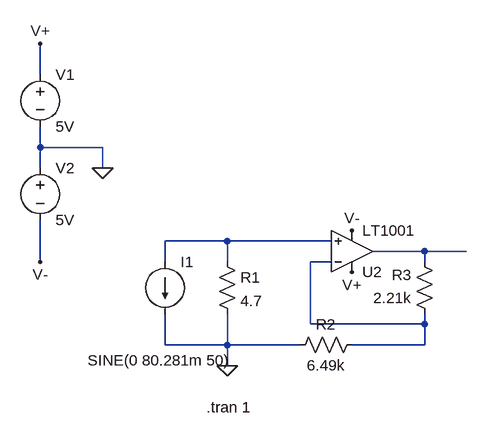
[diagram p0: schematic Strommessung.asc]
Strommessung.asc, the LTspice schematic file:
Version 4
SHEET 1 880 680
WIRE -256 -144 -256 -192
WIRE -256 -32 -256 -64
WIRE -160 -32 -256 -32
WIRE -256 0 -256 -32
WIRE -160 0 -160 -32
WIRE 32 112 -64 112
WIRE 192 112 32 112
WIRE 336 128 256 128
WIRE 400 128 336 128
WIRE -256 144 -256 80
WIRE -64 144 -64 112
WIRE 32 144 32 112
WIRE 192 144 160 144
WIRE 336 144 336 128
WIRE 160 240 160 144
WIRE 336 240 336 224
WIRE 336 240 160 240
WIRE -64 272 -64 224
WIRE 32 272 32 224
WIRE 32 272 -64 272
WIRE 144 272 32 272
WIRE 336 272 336 240
WIRE 336 272 224 272
WIRE 32 304 32 272
FLAG 224 160 V+
FLAG -256 -192 V+
FLAG 224 96 V-
FLAG -256 144 V-
FLAG -160 0 0
FLAG 32 304 0
SYMBOL voltage -256 -160 R0
WINDOW 123 0 0 Left 2
WINDOW 39 0 0 Left 2
SYMATTR InstName V1
SYMATTR Value 5V
SYMBOL voltage -256 -16 R0
WINDOW 123 0 0 Left 2
WINDOW 39 0 0 Left 2
SYMATTR InstName V2
SYMATTR Value 5V
SYMBOL current -64 144 R0
WINDOW 3 -119 152 Left 2
WINDOW 123 0 0 Left 2
WINDOW 39 0 0 Left 2
SYMATTR InstName I1
SYMATTR Value SINE(0 80.281m 50)
SYMBOL res 16 128 R0
SYMATTR InstName R1
SYMATTR Value 4.7
SYMBOL res 240 256 R90
WINDOW 0 0 56 VBottom 2
WINDOW 3 32 56 VTop 2
SYMATTR InstName R2
SYMATTR Value 6.49k
SYMBOL res 352 240 R180
WINDOW 0 36 76 Left 2
WINDOW 3 36 40 Left 2
SYMATTR InstName R3
SYMATTR Value 2.21k
SYMBOL Opamps\\LT1001 224 192 M180
SYMATTR InstName U2
TEXT 0 368 Left 2 !.tran 1

The netlist it stands for:
* Strommessung.asc
V1 V+ 0 5V
V2 0 V- 5V
I1 N001 0 SINE(0 80.281m 50)
R1 N001 0 4.7
R2 N003 0 6.49k
R3 N003 N002 2.21k
XU2 N001 N003 V+ V- N002 LT1001  ; pins In+ In- V+ V- OUT
.tran 1
.lib LTC.lib
.backanno
.end